# Altium schematic sheet MCISO-S06-V00-PSU3V3.SchDoc
size A4; SheetNumber: 12; SheetTotal: 14
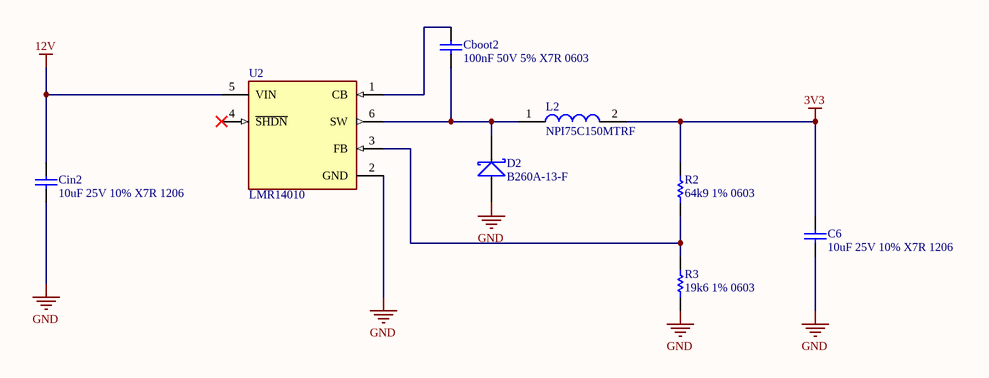
[diagram p0: MCISO-S06-V00-PSU3V3.SchDoc]

## Parts
C6  10uF 25V 10% X7R 1206  [Cap_Ceramic_1206]
Cboot2  100nF 50V 5% X7R 0603  [Cap_Ceramic_0603]
Cin2  10uF 25V 10% X7R 1206  [Cap_Ceramic_1206]
D2  B260A-13-F  [SMA]
L2  NPI75C150MTRF  [NPI75C150MTRF]
R2  64k9 1% 0603  [Res_ThinFilm_0603]
R3  19k6 1% 0603  [Res_ThinFilm_0603]
U2  LMR14010  [LMR14010]

## Nets
3V3: C6.2 L2.2 R2.2
12V: Cin2.2 U2.5(VIN)
GND: C6.1 Cin2.1 D2.A R3.1 U2.2(GND)
NetCboot2_1: Cboot2.1 D2.K L2.1 U2.6(SW)
NetCboot2_2: Cboot2.2 U2.1(CB)
NetR2_1: R2.1 R3.2 U2.3(FB)

Not connected (* = marked no-connect by the designer): U2 4(~{SHDN})*

## Library data of the parts
C6 Cin2 = 10uF 25V 10% X7R 1206: Capacitor, Ceramic, SMD, 10uF, 25V, 10%, X7R, 1206
Cboot2 = 100nF 50V 5% X7R 0603: Capacitor, Ceramic, SMD, 100nF, 50V, 5%, X7R, 0603
D2 = B260A-13-F: Diode, Schottky Barrier Rectifier, 60 V, 2 A, B260A-13-F
L2 = NPI75C150MTRF: Ind Power Unshielded Wirewound 15uH 20% 1KHz 1.8A T/R
R2 = 64k9 1% 0603: Resistor, SMD, 64k9, 0.1W, 5%, 0603
R3 = 19k6 1% 0603: Resistor, SMD, 19k6, 0.1W, 5%, 0603